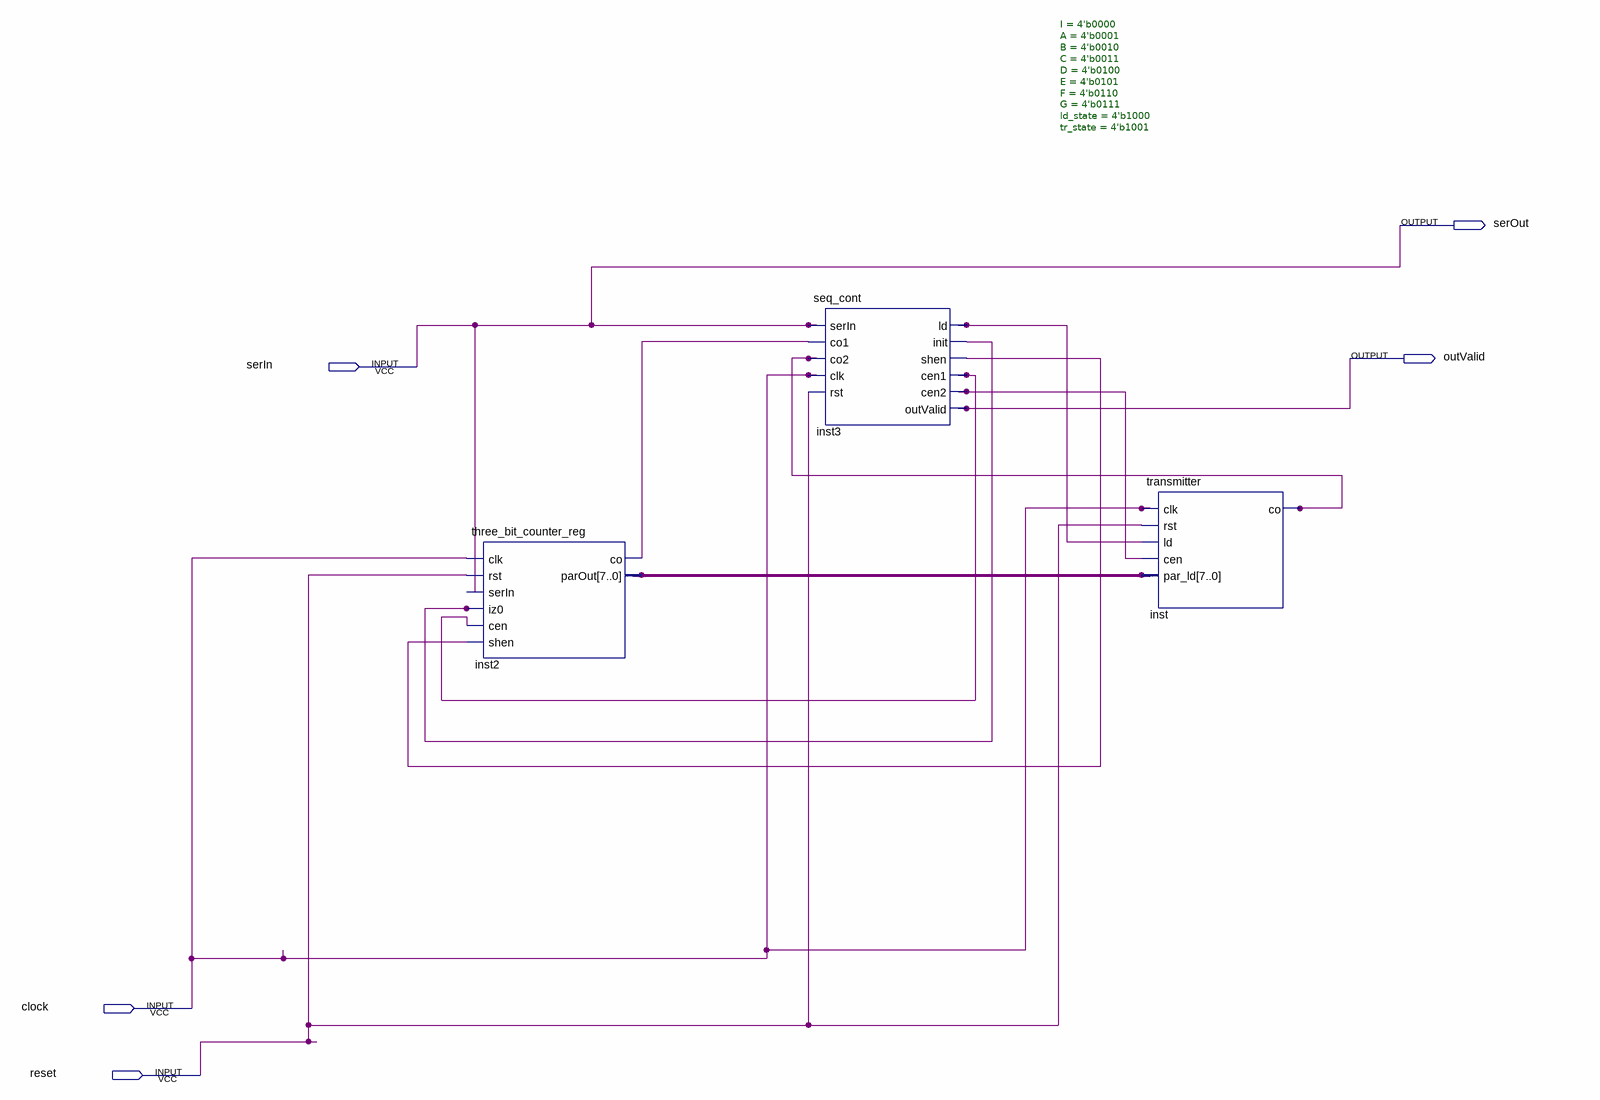
[diagram p0: schematic sheet]
// Quartus schematic complete.bdf as structural Verilog: 3 symbols, 5 pins
module complete (
  input  serIn,
  input  clock,
  input  reset,
  output serOut,
  output outValid
);

  wire inst2_co, inst3_cen1, inst3_cen2, inst3_init, inst3_ld, inst3_shen, inst_co;
  wire [7:0] inst2_parout;

  three_bit_counter_reg inst2 (
    .clk(clock), .rst(reset), .iz0(inst3_init), .cen(inst3_cen1), .shen(inst3_shen), .co(inst2_co),
    .parOut(inst2_parout));  // open: serIn
  seq_cont #(.I(4'b0000), .A(4'b0001), .B(4'b0010), .C(4'b0011), .D(4'b0100), .E(4'b0101), .F(4'b0110), .G(4'b0111), .ld_state(4'b1000), .tr_state(4'b1001)) inst3 (
    .serIn(serIn), .co1(inst2_co), .co2(inst_co), .clk(clock), .rst(reset), .ld(inst3_ld), .init(inst3_init),
    .shen(inst3_shen), .cen1(inst3_cen1), .cen2(inst3_cen2), .outValid(outValid));
  transmitter inst (.clk(clock), .rst(reset), .ld(inst3_ld), .cen(inst3_cen2), .par_ld(inst2_parout), .co(inst_co));

  assign serOut = serIn;
endmodule
